# EAGLE design v1 (EAGLE 6.4)
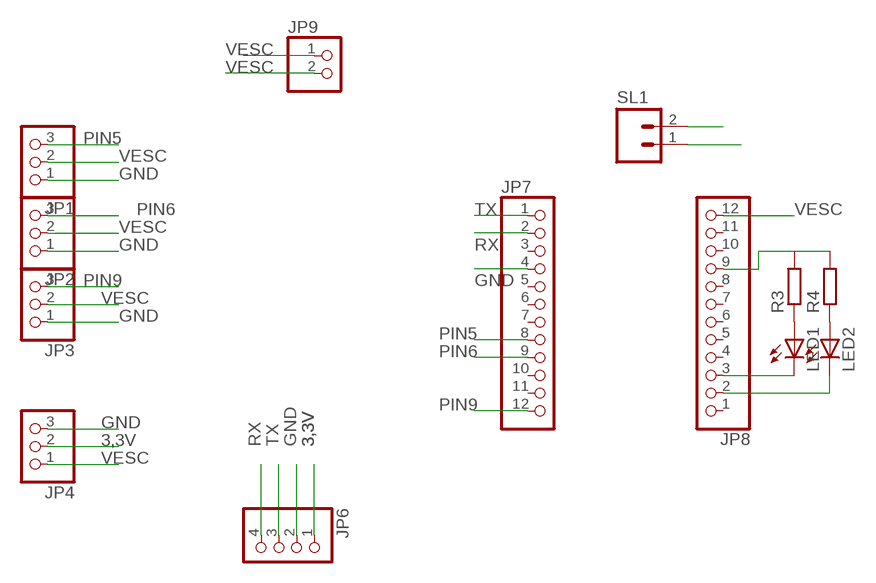
[diagram p0: schematic, sheet 1]

## Parts
JP1  PINHD-1X3  [1X03]
JP2  PINHD-1X3  [1X03]
JP3  PINHD-1X3  [1X03]
JP4  PINHD-1X3  [1X03]
JP6  PINHD-1X4  [1X04]
JP7  PINHD-1X12  [1X12]
JP8  PINHD-1X12  [1X12]
JP9  PINHD-1X2  [1X02]
LED1  LED3MM  [LED3MM]
LED2  LED3MM  [LED3MM]
R3  R-EU_0207/7  [0207/7]
R4  R-EU_0207/7  [0207/7]
SL1  M02  [02P]

## Nets
3,3V: JP4.2 JP6.1
GND: JP1.1 JP2.1 JP3.1 JP4.3 JP6.2 JP7.4 SL1.2
N$1: JP8.9 R3.2 R4.2
N$2: JP8.2 LED2.K(C)
N$4: JP8.3 LED1.K(C)
N$6: LED1.A R3.1
N$7: LED2.A R4.1
PIN5: JP1.3 JP7.8
PIN6: JP2.3 JP7.9
PIN9: JP3.3 JP7.12
RX: JP6.4 JP7.2
TX: JP6.3 JP7.1
VESC: JP1.2 JP2.2 JP3.2 JP4.1 JP8.12 JP9.1 JP9.2 SL1.1
Unconnected: JP7.3 JP7.5 JP7.6 JP7.7 JP7.10 JP7.11 JP8.1 JP8.4 JP8.5 JP8.6 JP8.7 JP8.8 JP8.10 JP8.11

## Library data of the parts
JP1-JP4 = pinhead:PINHD-1X3: PIN HEADER
JP6 = pinhead:PINHD-1X4: PIN HEADER
JP7 JP8 = pinhead:PINHD-1X12: PIN HEADER
JP9 = pinhead:PINHD-1X2: PIN HEADER
LED1 LED2 = led:LED: LED OSRAM: - CHIPLED LG R971, LG N971, LY N971, LG Q971, LY Q971, LO R971, LY R971 LH N974, LH R974 LS Q976, LO Q976, LY Q976 LO Q996 - Hyper CHIPLED LW Q18S LB Q993, LB Q99A, LB R99A - SideLED LS A670, LO A670, LY A670, LG A670, LP A670 LB A673, LV A673, LT A673, LW A673 LH A674 LY A675 LS A676, LA A676, LO A676, LY A676, LW A676 LS A679, LY A679, LG A679 - Hyper Micro SIDELED® LS Y876, LA Y876, LO Y876, LY Y876 LT Y87S - SmartLED LW L88C, LW L88S LB L89C, LB L89S, LG L890 LS L89K, LO L89K, LY L89K LS L896, LA L896, LO L896, LY L896 - TOPLED LS T670, LO T670, LY T670, LG T670, LP T670 LSG T670, LSP T670, LSY T670, LOP T670, LYG T670 LG T671, LOG T671, LSG T671 LB T673, LV T673, LT T673, LW T673 LH T674 LS T676, LA T676, LO T676, LY T676, LB T676, LH T676, LSB T676, LW T676 LB T67C, LV T67C, LT T67C, LS T67K, LO T67K, LY T67K, LW E67C LS E67B, LA E67B, LO E67B, LY E67B, LB E67C, LV E67C, LT E67C LW T67C LS T679, LY T679, LG T679 LS T770, LO T770, LY T770, LG T770, LP T770 LB T773, LV T773, LT T773, LW T773 LH T774 LS E675, LA E675, LY E675, LS T675 LS T776, LA T776, LO T776, LY T776, LB T776 LHGB T686 LT T68C, LB T68C - Hyper Mini TOPLED® LB M676 - Mini TOPLED Santana® LG M470 LS M47K, LO M47K, LY M47K Source: http://www.osram.convergy.de LUXEON: - LUMILED® LXK2-PW12-R00, LXK2-PW12-S00, LXK2-PW14-U00, LXK2-PW14-V00 LXK2-PM12-R00, LXK2-PM12-S00, LXK2-PM14-U00 LXK2-PE12-Q00, LXK2-PE12-R00, LXK2-PE12-S00, LXK2-PE14-T00, LXK2-PE14-U00 LXK2-PB12-K00, LXK2-PB12-L00, LXK2-PB12-M00, LXK2-PB14-N00, LXK2-PB14-P00, LXK2-PB14-Q00 LXK2-PR12-L00, LXK2-PR12-M00, LXK2-PR14-Q00, LXK2-PR14-R00 LXK2-PD12-Q00, LXK2-PD12-R00, LXK2-PD12-S00 LXK2-PH12-R00, LXK2-PH12-S00 LXK2-PL12-P00, LXK2-PL12-Q00, LXK2-PL12-R00 Source: www.luxeon.com KINGBRIGHT: KA-3528ASYC Source: www.kingbright.com
R3 R4 = rcl:R-EU_: RESISTOR, European symbol
SL1 = con-amp-quick:M02: AMP QUICK CONNECTOR; OC_FARNELL: unknown; OC_NEWARK: unknown

## Board
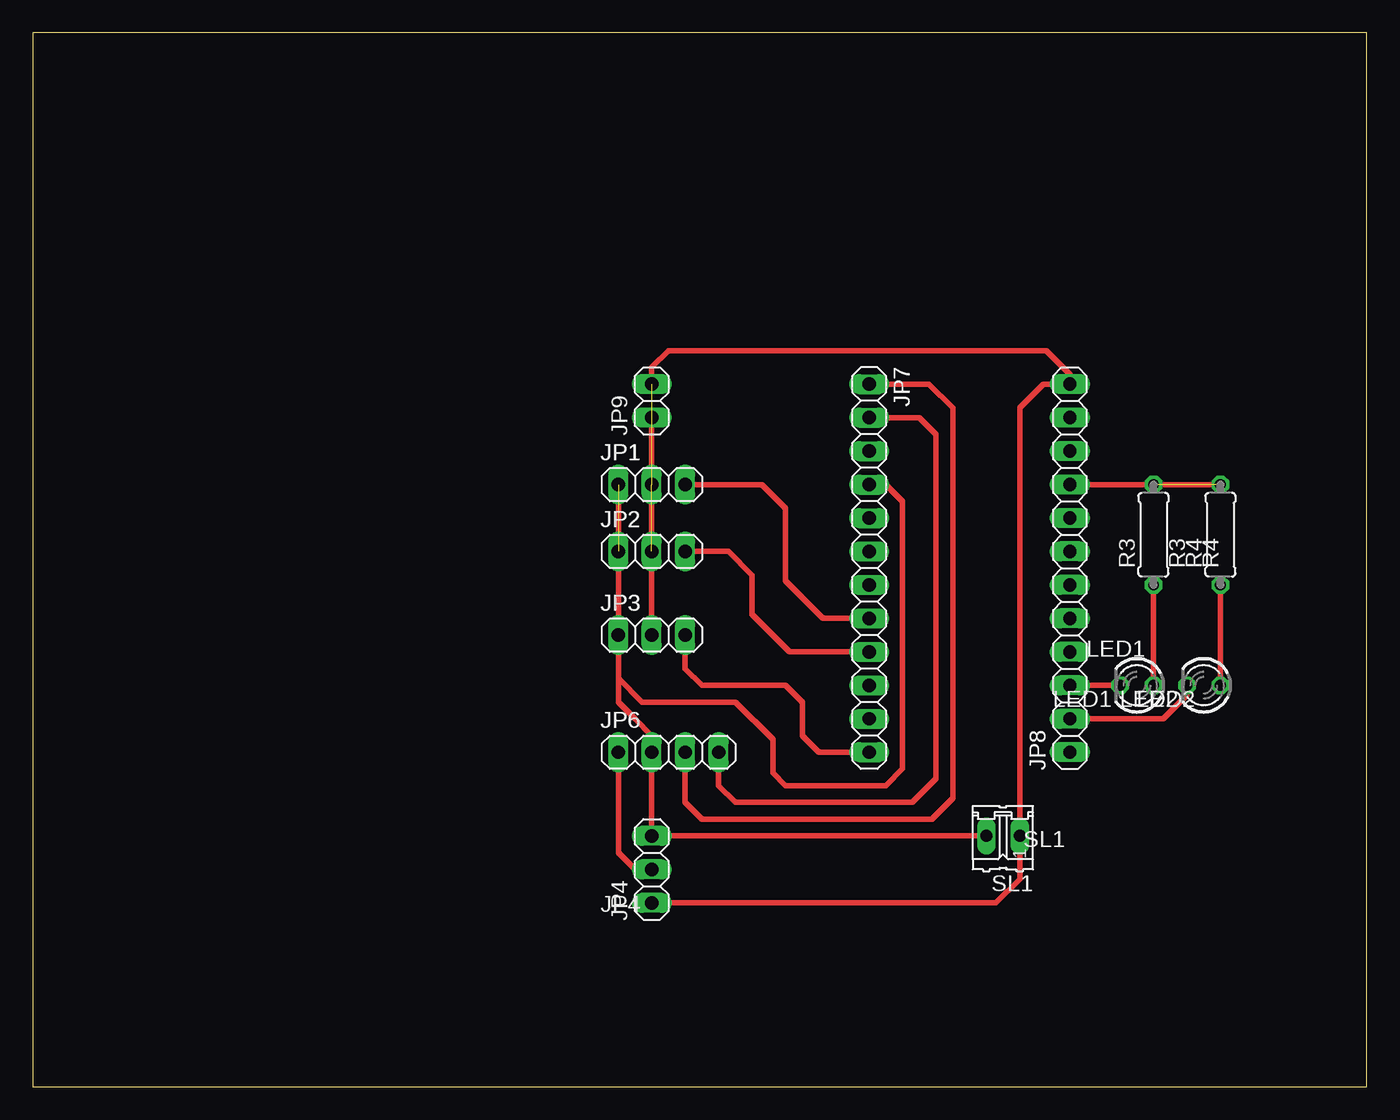
[diagram p1: board, top side]
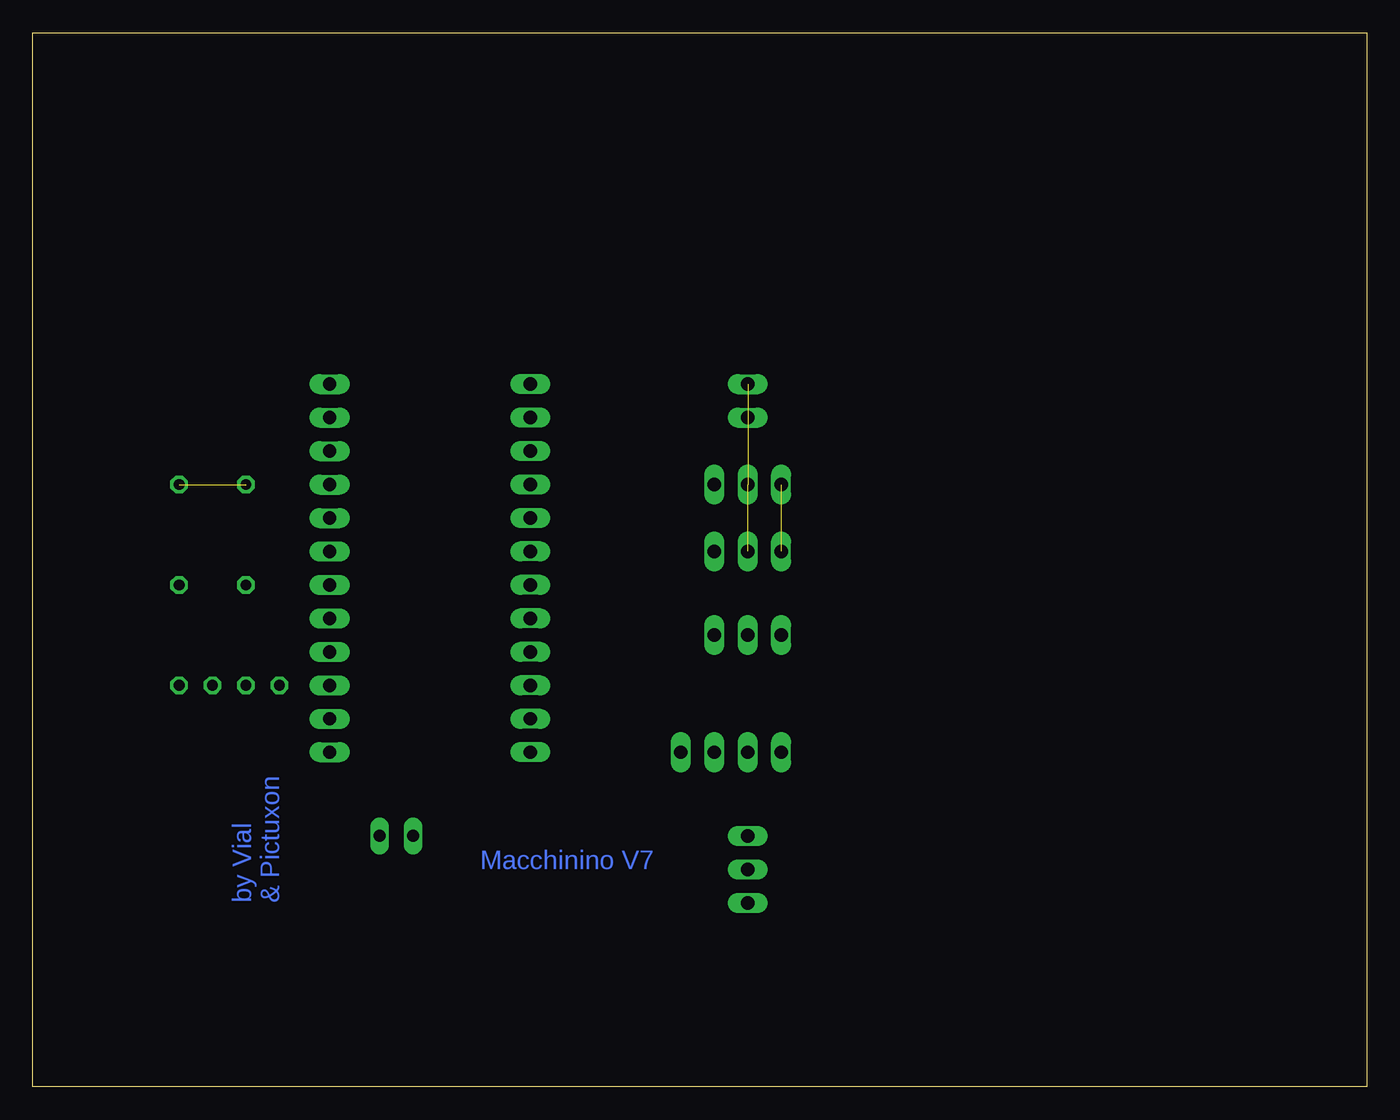
[diagram p2: board, bottom side, seen from below]

Size 101.27 x 80 mm. Coordinates in mm from the lower left corner, seen from the top.
Outline: 0,0 101.27,0 101.27,80 0,80 0,0
Copper layers (1*16): Top 0.035mm / dielectric 1.5mm / Bottom 0.035mm
Design rules "default": minimum track width 10mil, minimum drill 24mil, track to track 8mil, track to pad 8mil, pad to pad 8mil, via to via 8mil, smd to smd 8mil, copper to edge 40mil, drill to drill 8mil, minimum pad ring 10mil, minimum via ring 8mil, stop-mask expansion 4mil, vias tented up to drill 0mil, thermal gap 10mil

### Footprints (pad centres in the part's own frame; a part is rotated, then mirrored left to right if it is on the bottom)
1X03 = drill 1.016 long: 1 -2.54,0; 2 0,0; 3 2.54,0
1X04 = drill 1.016 long: 1 -3.81,0; 2 -1.27,0; 3 1.27,0; 4 3.81,0
1X12 = drill 1.016 long: 1 -13.97,0; 2 -11.43,0; 3 -8.89,0; 4 -6.35,0; 5 -3.81,0; 6 -1.27,0; 7 1.27,0; 8 3.81,0; 9 6.35,0; 10 8.89,0; 11 11.43,0; 12 13.97,0
1X02 = drill 1.016 long: 1 -1.27,0; 2 1.27,0
LED3MM = drill 0.813 octagon: A -1.27,0; K 1.27,0
0207/7 = drill 0.813 octagon: 1 -3.81,0; 2 3.81,0
02P = drill 0.914 long: 1 -1.27,0; 2 1.27,0

### Placement (x,y rotation side)
JP1  46.99,45.72 0 top
JP2  46.99,40.64 0 top
JP3  46.99,34.29 0 top
JP4  46.99,16.51 90 top
JP6  48.26,25.4 0 top
JP7  63.5,39.37 270 top
JP8  78.74,39.37 90 top
JP9  46.99,52.07 90 top
LED1  83.82,30.48 180 top
LED2  88.9,30.48 180 top
R3  85.09,41.91 90 top
R4  90.17,41.91 90 top
SL1  73.66,19.05 180 top

### Tracks (layer width: path | path; a pad name or v marks a point on that pad's centre or on a via)
3,3V
  Top 0.406: JP4.2 45.72,16.51 44.45,17.78 JP6.1
GND  (1 unrouted)
  Top 0.406: JP1.1 JP3.1 44.45,31.75 44.45,31.01 | JP7.4 64.77,45.72 66.04,44.45 66.04,24.13 64.77,22.86 57.15,22.86 56.18,23.83 56.18,26.37 53.34,29.21 46.25,29.21 44.45,31.01 | SL1.2 JP4.3 JP6.2 46.99,26.67 45.72,27.94 44.45,29.21 44.45,31.01
N$1  (1 unrouted)
  Top 0.406: JP8.9 R4.2
N$2
  Top 0.406: JP8.2 85.83,27.94 87.63,29.74 LED2.K
N$4
  Top 0.406: JP8.3 LED1.K
N$6
  Top 0.406: LED1.A R3.1
N$7
  Top 0.406: LED2.A R4.1
PIN5
  Top 0.406: JP1.3 55.35,45.72 57.15,43.92 57.15,38.4 59.99,35.56 JP7.8
PIN6
  Top 0.406: JP2.3 52.81,40.64 54.61,38.84 54.61,35.86 57.45,33.02 JP7.9
PIN9
  Top 0.406: JP3.3 49.53,31.75 50.8,30.48 57.15,30.48 58.42,29.21 58.42,26.67 59.69,25.4 JP7.12
RX
  Top 0.406: JP7.2 67.31,50.8 68.58,49.53 68.58,23.39 66.78,21.59 53.34,21.59 52.07,22.86 JP6.4
TX
  Top 0.406: JP6.3 49.53,21.59 50.8,20.32 68.28,20.32 69.85,21.89 69.85,51.54 68.05,53.34 JP7.1
VESC  (3 unrouted)
  Top 0.406: JP3.2 JP9.1 | JP9.2 46.99,54.61 48.26,55.88 76.94,55.88 78.74,54.08 JP8.12 76.73,53.34 74.93,51.54 SL1.1 74.93,15.77 73.13,13.97 JP4.1

### Text on the board
Bottom: Macchinino V7 | by Vial / & Pictuxon
_tNames: JP7 | JP1 | JP2 | R3 | R4 | JP3 | LED1 | LED2 | JP6 | JP8 | SL1 | JP4